# Altium schematic sheet auido.SchDoc
size A; SheetNumber: 4; SheetTotal: 5
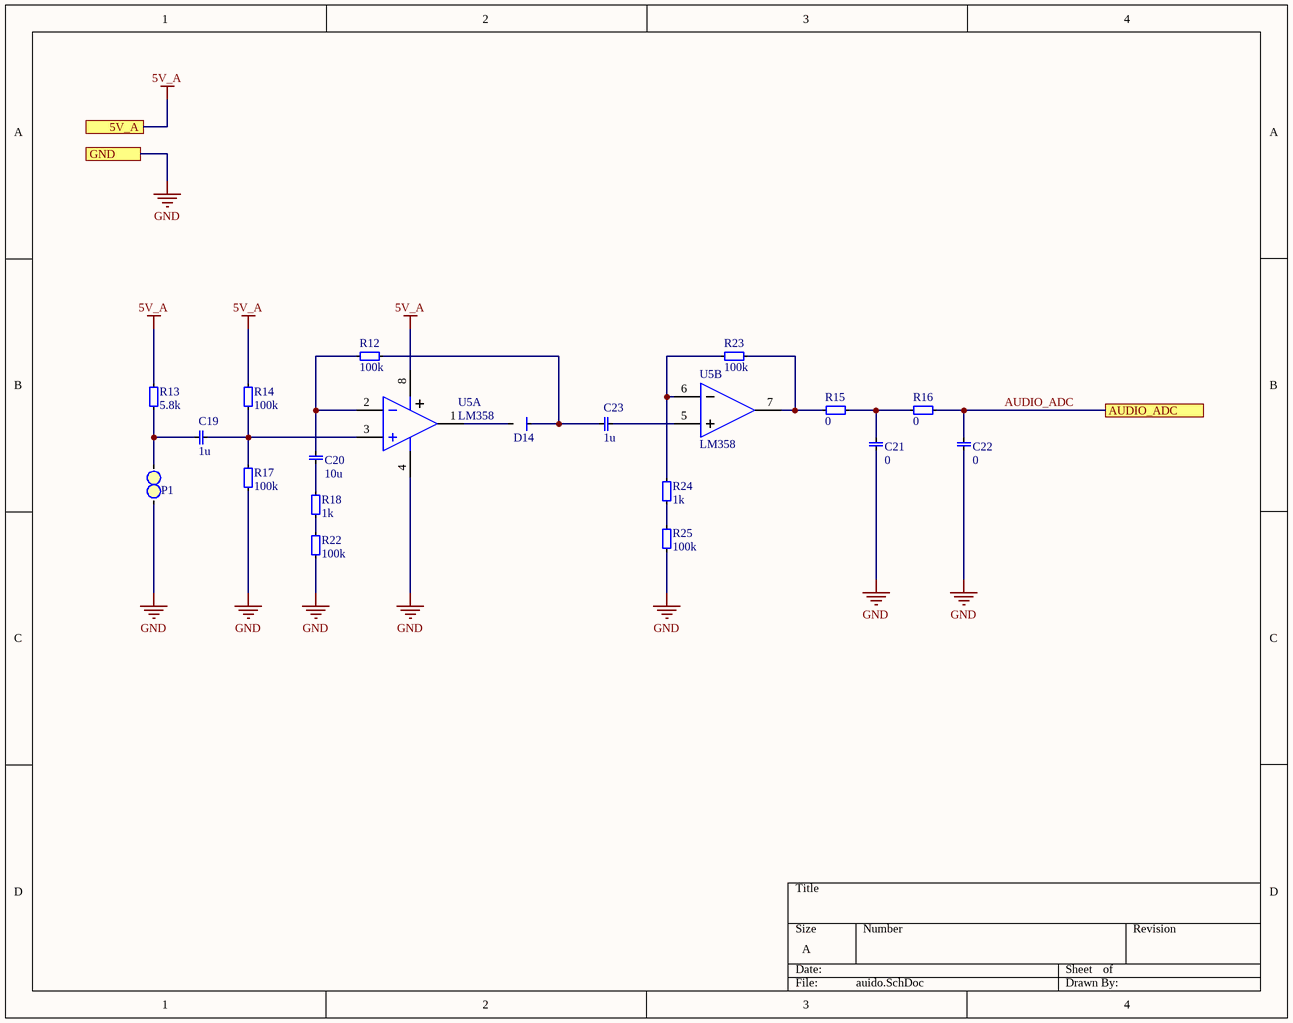
[diagram p0: auido.SchDoc]

## Parts
C19  value 1u  [0603 cap]  (hidden comment: 0603, capacitor)
C20  value 10u  [0603 cap]  (hidden comment: 0603, capacitor)
C21  value 0  [0603 cap]  (hidden comment: 0603, capacitor)
C22  value 0  [0603 cap]  (hidden comment: 0603, capacitor)
C23  value 1u  [0603 cap]  (hidden comment: 0603, capacitor)
D14  Diode, SMD  [SOD323]  (value not drawn)
P1  1x2 Pin Heade Straight  [padtwo_L]  (value not drawn)
R12  value 100k  [0603]  (hidden comment: 0603, resistor)
R13  value 5.8k  [0603]  (hidden comment: 0603, resistor)
R14  value 100k  [0603]  (hidden comment: 0603, resistor)
R15  value 0  [0603]  (hidden comment: 0603, resistor)
R16  value 0  [0603]  (hidden comment: 0603, resistor)
R17  value 100k  [0603]  (hidden comment: 0603, resistor)
R18  value 1k  [0603]  (hidden comment: 0603, resistor)
R22  value 100k  [0603]  (hidden comment: 0603, resistor)
R23  value 100k  [0603]  (hidden comment: 0603, resistor)
R24  value 1k  [0603]  (hidden comment: 0603, resistor)
R25  value 100k  [0603]  (hidden comment: 0603, resistor)
U5  LM358  [SOIC8]  (parts A,B of 2)

## Ports
5V_A, AUDIO_ADC, GND

## Nets
5V_A: R13.0 R14.0 U5.8(V+) ; port 5V_A
GND: C21.0 C22.0 P1.2 R17.1 R22.1 R25.1 U5.4(V-) ; port GND
AUDIO_ADC: C22.1 R16.1 ; port AUDIO_ADC
NetC19_0: C19.0 R14.1 R17.0 U5.3(IN+)
NetC19_1: C19.1 P1.1 R13.1
NetC20_0: C20.0 R18.0
NetC20_1: C20.1 R12.0 U5.2(IN-)
NetC21_1: C21.1 R15.1 R16.0
NetC23_0: C23.0 U5.5(IN+)
NetC23_1: C23.1 D14.1 R12.1
NetD14_2: D14.2 U5.1(OUT1)
NetR15_0: R15.0 R23.1 U5.7(OUT2)
NetR18_1: R18.1 R22.0
NetR23_0: R23.0 R24.0 U5.6(IN-)
NetR24_1: R24.1 R25.0

## Library data of the parts
P1 = 1x2 Pin Heade Straight: 2.54 mm, TH; Value: 1x2 Pin Header
U5 = LM358: Dual FET-Input Operational Amplifier; Part Number: LM358P; Value: 595-LM358P; Cost (kr): 4,04; Order code: *
C19-C23 = 0603, capacitor: Order number: *